# Altium schematic sheet Bistable Multivibrator.schdoc: Bistable Multivibrator
size A4; Organization: Altium Limited; Address1: L3, 12a Rodborough Rd; Address2: Frenchs Forest; Address3: NSW; Address4: Australia 2086; DocumentNumber: 1; SheetNumber: 1; SheetTotal: 1
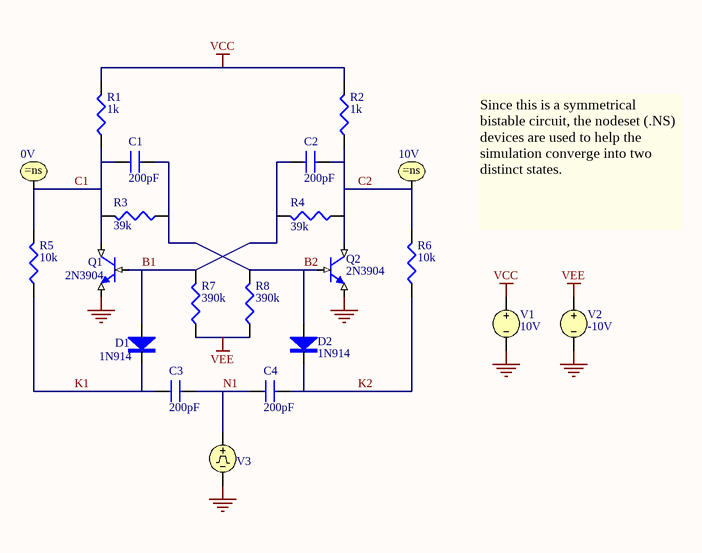
[diagram p0: Bistable Multivibrator.schdoc]

## Parts
C1  200pF
C2  200pF
C3  200pF
C4  200pF
D1  1N914
D2  1N914
NS1  0V
NS2  10V
Q1  2N3904
Q2  2N3904
R1  1k
R2  1k
R3  39k
R4  39k
R5  10k
R6  10k
R7  390k
R8  390k
V1  10V
V2  -10V
V3  VPULSE  (value not drawn)

## Nets
GND: Q1.3(E) Q2.3(E) V1.2 V2.2 V3.2
VCC: R1.1(TOP) R2.1(TOP) V1.1
VEE: R7.2(BOT) R8.2(BOT) V2.1
B1: C2.1 D1.1(A) Q1.2(B) R4.1(TOP) R7.1(TOP)
B2: C1.2 D2.1(A) Q2.2(B) R3.2(BOT) R8.1(TOP)
C1: C1.1 NS1.1 Q1.1(C) R1.2(BOT) R3.1(TOP) R5.1(TOP)
C2: C2.2 NS2.1 Q2.1(C) R2.2(BOT) R4.2(BOT) R6.1(TOP)
K1: C3.1 D1.2(K) R5.2(BOT)
K2: C4.2 D2.2(K) R6.2(BOT)
N1: C3.2 C4.1 V3.1

## Notes on the sheet
- Since this is a symmetrical bistable circuit, the nodeset (.NS) devices are used to help the simulation converge into two distinct states.
- Title
- Size:
- Date:
- A4
- Number:
- Time:
- Revision:
- Sheet
- of
- File:

## Library data of the parts
C1-C4 = CAP: Capacitor; Value: 200pF
D1 D2 = 1N914: Diode
NS1 NS2 = .NS: Node Set
  NS1: Initial Voltage: 0V
  NS2: Initial Voltage: 10V
Q1 Q2 = 2N3904: NPN BJT
R1-R8 = RES: Resistor
  R1 R2: Value: 1k
  R3 R4: Value: 39k
  R5 R6: Value: 10k
  R7 R8: Value: 390k
V1 V2 = VSRC: Voltage Source
  V1: Value: 10V
  V2: Value: -10V
V3 = VPULSE: Pulse Voltage Source